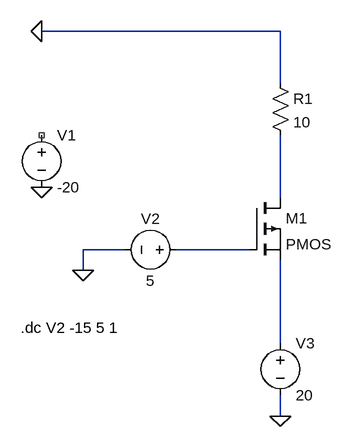
[diagram p0: schematic I_v_char_test.asc]
I_v_char_test.asc, the LTspice schematic file:
Version 4.1
SHEET 1 880 680
WIRE 400 -48 32 -48
WIRE 400 32 400 -48
WIRE 400 208 400 112
WIRE 160 288 96 288
WIRE 352 288 240 288
WIRE 96 320 96 288
WIRE 400 432 400 304
WIRE 400 544 400 512
FLAG 32 192 0
FLAG 96 320 0
FLAG 400 544 0
FLAG 32 -48 0
SYMBOL voltage 32 96 R0
WINDOW 123 0 0 Left 0
WINDOW 39 0 0 Left 0
SYMATTR InstName V1
SYMATTR Value -20
SYMBOL res 384 16 R0
SYMATTR InstName R1
SYMATTR Value 10
SYMBOL voltage 256 288 R90
WINDOW 0 -32 56 VBottom 2
WINDOW 3 32 56 VTop 2
WINDOW 123 0 0 Left 0
WINDOW 39 0 0 Left 0
SYMATTR InstName V2
SYMATTR Value 5
SYMBOL pmos 352 208 R0
SYMATTR InstName M1
SYMBOL voltage 400 416 R0
WINDOW 123 0 0 Left 0
WINDOW 39 0 0 Left 0
SYMATTR InstName V3
SYMATTR Value 20
TEXT 0 408 Left 2 !.dc V2 -15 5 1

The netlist it stands for:
* I_v_char_test.asc
V1 NC_01 0 -20
R1 0 N001 10
V2 N002 0 5
M1 N001 N002 N003 N003 PMOS
V3 N003 0 20
.model NMOS NMOS
.model PMOS PMOS
.lib standard.mos
.dc V2 -15 5 1
.backanno
.end